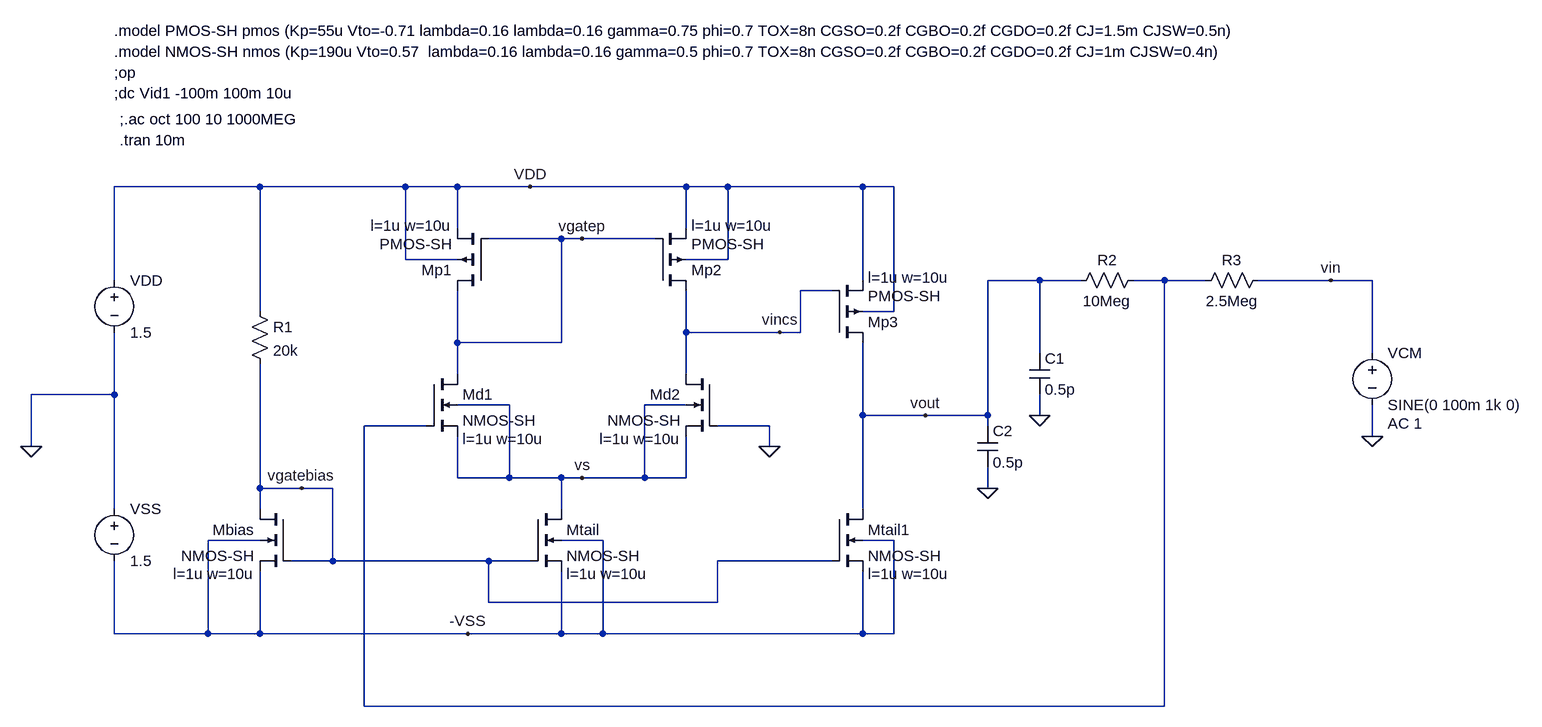
[diagram p0: schematic 3_diff_pair_cs-as-opamp-step.asc]
3_diff_pair_cs-as-opamp-step.asc, the LTspice schematic file:
Version 4
SHEET 1 1092 740
WIRE -976 -64 -1200 -64
WIRE -752 -64 -976 -64
WIRE -672 -64 -752 -64
WIRE -560 -64 -672 -64
WIRE -320 -64 -560 -64
WIRE -256 -64 -320 -64
WIRE -48 -64 -256 -64
WIRE 0 -64 -48 -64
WIRE -672 0 -672 -64
WIRE -320 0 -320 -64
WIRE -512 16 -624 16
WIRE -480 16 -512 16
WIRE -368 16 -480 16
WIRE -752 48 -752 -64
WIRE -672 48 -752 48
WIRE -256 48 -256 -64
WIRE -256 48 -320 48
WIRE -1200 80 -1200 -64
WIRE -48 80 -48 -64
WIRE 224 80 144 80
WIRE 288 80 224 80
WIRE 416 80 368 80
WIRE 480 80 416 80
WIRE 672 80 560 80
WIRE 736 80 672 80
WIRE -96 96 -144 96
WIRE -976 128 -976 -64
WIRE 0 128 0 -64
WIRE 0 128 -48 128
WIRE -320 160 -320 96
WIRE -176 160 -320 160
WIRE -144 160 -144 96
WIRE -144 160 -176 160
WIRE -672 176 -672 96
WIRE -512 176 -512 16
WIRE -512 176 -672 176
WIRE 224 192 224 80
WIRE 736 192 736 80
WIRE -672 224 -672 176
WIRE -320 224 -320 160
WIRE -1200 256 -1200 160
WIRE -1200 256 -1328 256
WIRE -592 272 -672 272
WIRE -320 272 -384 272
WIRE -48 288 -48 176
WIRE 48 288 -48 288
WIRE 144 288 144 80
WIRE 144 288 48 288
WIRE 224 288 224 256
WIRE -720 304 -816 304
WIRE -192 304 -272 304
WIRE 144 304 144 288
WIRE 736 320 736 272
WIRE -1328 336 -1328 256
WIRE -192 336 -192 304
WIRE -672 384 -672 320
WIRE -592 384 -592 272
WIRE -592 384 -672 384
WIRE -512 384 -592 384
WIRE -480 384 -512 384
WIRE -384 384 -384 272
WIRE -384 384 -480 384
WIRE -320 384 -320 320
WIRE -320 384 -384 384
WIRE -976 400 -976 208
WIRE -912 400 -976 400
WIRE -864 400 -912 400
WIRE 144 400 144 368
WIRE -1200 432 -1200 256
WIRE -976 432 -976 400
WIRE -512 432 -512 384
WIRE -48 432 -48 288
WIRE -976 480 -1056 480
WIRE -448 480 -512 480
WIRE 0 480 -48 480
WIRE -864 512 -864 400
WIRE -864 512 -928 512
WIRE -624 512 -864 512
WIRE -560 512 -624 512
WIRE -96 512 -272 512
WIRE -624 576 -624 512
WIRE -272 576 -272 512
WIRE -272 576 -624 576
WIRE -1200 624 -1200 512
WIRE -1056 624 -1056 480
WIRE -1056 624 -1200 624
WIRE -976 624 -976 528
WIRE -976 624 -1056 624
WIRE -656 624 -976 624
WIRE -512 624 -512 528
WIRE -512 624 -656 624
WIRE -448 624 -448 480
WIRE -448 624 -512 624
WIRE -48 624 -48 528
WIRE -48 624 -448 624
WIRE 0 624 0 480
WIRE 0 624 -48 624
WIRE -816 736 -816 304
WIRE 416 736 416 80
WIRE 416 736 -816 736
FLAG -1328 336 0
FLAG 736 320 0
FLAG 224 288 0
FLAG -480 384 vs
FLAG -912 400 vgatebias
FLAG -480 16 vgatep
FLAG -560 -64 VDD
FLAG -656 624 -VSS
FLAG 144 400 0
FLAG -192 336 0
FLAG 48 288 vout
FLAG -176 160 vincs
FLAG 672 80 vin
SYMBOL nmos4 -720 224 R0
WINDOW 123 56 100 Left 2
SYMATTR Value2 l=1u w=10u
SYMATTR InstName Md1
SYMATTR Value NMOS-SH
SYMBOL voltage -1200 416 R0
WINDOW 123 0 0 Left 2
WINDOW 39 0 0 Left 2
SYMATTR InstName VSS
SYMATTR Value 1.5
SYMBOL nmos4 -272 224 M0
WINDOW 123 56 100 Left 2
SYMATTR Value2 l=1u w=10u
SYMATTR InstName Md2
SYMATTR Value NMOS-SH
SYMBOL nmos4 -560 432 R0
WINDOW 123 56 100 Left 2
SYMATTR Value2 l=1u w=10u
SYMATTR InstName Mtail
SYMATTR Value NMOS-SH
SYMBOL pmos4 -368 96 M180
WINDOW 123 56 100 Left 2
SYMATTR Value2 l=1u w=10u
SYMATTR InstName Mp2
SYMATTR Value PMOS-SH
SYMBOL pmos4 -624 96 R180
WINDOW 123 56 100 Left 2
SYMATTR Value2 l=1u w=10u
SYMATTR InstName Mp1
SYMATTR Value PMOS-SH
SYMBOL nmos4 -928 432 M0
WINDOW 123 56 100 Left 2
SYMATTR Value2 l=1u w=10u
SYMATTR InstName Mbias
SYMATTR Value NMOS-SH
SYMBOL res -992 112 R0
SYMATTR InstName R1
SYMATTR Value 20k
SYMBOL voltage -1200 64 R0
WINDOW 123 0 0 Left 2
WINDOW 39 0 0 Left 2
SYMATTR InstName VDD
SYMATTR Value 1.5
SYMBOL voltage 736 176 R0
WINDOW 123 24 124 Left 2
WINDOW 39 0 0 Left 2
SYMATTR Value2 AC 1
SYMATTR InstName VCM
SYMATTR Value SINE(0 100m 1k 0)
SYMBOL cap 208 192 R0
SYMATTR InstName C1
SYMATTR Value 0.5p
SYMBOL res 272 96 R270
WINDOW 0 32 56 VTop 2
WINDOW 3 0 56 VBottom 2
SYMATTR InstName R2
SYMATTR Value 10Meg
SYMBOL res 464 96 R270
WINDOW 0 32 56 VTop 2
WINDOW 3 0 56 VBottom 2
SYMATTR InstName R3
SYMATTR Value 2.5Meg
SYMBOL cap 128 304 R0
SYMATTR InstName C2
SYMATTR Value 0.5p
SYMBOL pmos4 -96 176 M180
WINDOW 123 56 100 Left 2
SYMATTR Value2 l=1u w=10u
SYMATTR InstName Mp3
SYMATTR Value PMOS-SH
SYMBOL nmos4 -96 432 R0
WINDOW 123 56 100 Left 2
SYMATTR Value2 l=1u w=10u
SYMATTR InstName Mtail1
SYMATTR Value NMOS-SH
TEXT -1200 -208 Left 2 !;dc Vid1 -100m 100m 10u
TEXT -1200 -240 Left 2 !;op
TEXT -1192 -168 Left 2 !;.ac oct 100 10 1000MEG
TEXT -1192 -136 Left 2 !.tran 10m
TEXT -1200 -304 Left 2 !.model PMOS-SH pmos (Kp=55u Vto=-0.71 lambda=0.16 lambda=0.16 gamma=0.75 phi=0.7 TOX=8n CGSO=0.2f CGBO=0.2f CGDO=0.2f CJ=1.5m CJSW=0.5n)
TEXT -1200 -272 Left 2 !.model NMOS-SH nmos (Kp=190u Vto=0.57  lambda=0.16 lambda=0.16 gamma=0.5 phi=0.7 TOX=8n CGSO=0.2f CGBO=0.2f CGDO=0.2f CJ=1m CJSW=0.4n)

The netlist it stands for:
* 3_diff_pair_cs-as-opamp-step.asc
Md1 vgatep N001 vs vs NMOS-SH l=1u w=10u
VSS 0 -VSS 1.5
Md2 vincs 0 vs vs NMOS-SH l=1u w=10u
Mtail vs vgatebias -VSS -VSS NMOS-SH l=1u w=10u
Mp2 vincs vgatep VDD VDD PMOS-SH l=1u w=10u
Mp1 vgatep vgatep VDD VDD PMOS-SH l=1u w=10u
Mbias vgatebias vgatebias -VSS -VSS NMOS-SH l=1u w=10u
R1 VDD vgatebias 20k
VDD VDD 0 1.5
VCM vin 0 SINE(0 100m 1k 0) AC 1
C1 vout 0 0.5p
R2 vout N001 10Meg
R3 N001 vin 2.5Meg
C2 vout 0 0.5p
Mp3 vout vincs VDD VDD PMOS-SH l=1u w=10u
Mtail1 vout vgatebias -VSS -VSS NMOS-SH l=1u w=10u
.model NMOS NMOS
.model PMOS PMOS
.lib standard.mos
;dc Vid1 -100m 100m 10u
;op
;.ac oct 100 10 1000MEG
.tran 10m
.model PMOS-SH pmos (Kp=55u Vto=-0.71 lambda=0.16 lambda=0.16 gamma=0.75 phi=0.7 TOX=8n CGSO=0.2f CGBO=0.2f CGDO=0.2f CJ=1.5m CJSW=0.5n)
.model NMOS-SH nmos (Kp=190u Vto=0.57  lambda=0.16 lambda=0.16 gamma=0.5 phi=0.7 TOX=8n CGSO=0.2f CGBO=0.2f CGDO=0.2f CJ=1m CJSW=0.4n)
.backanno
.end